# EasyEDA schematic 1-Schematic_PWM 四线 风扇控制器.json
TITLE: Sheet_1; REV: 1.0; Date: 2021-08-22; Sheet: 1/1; Drawn By: GloomyGhost; Company: Your Company
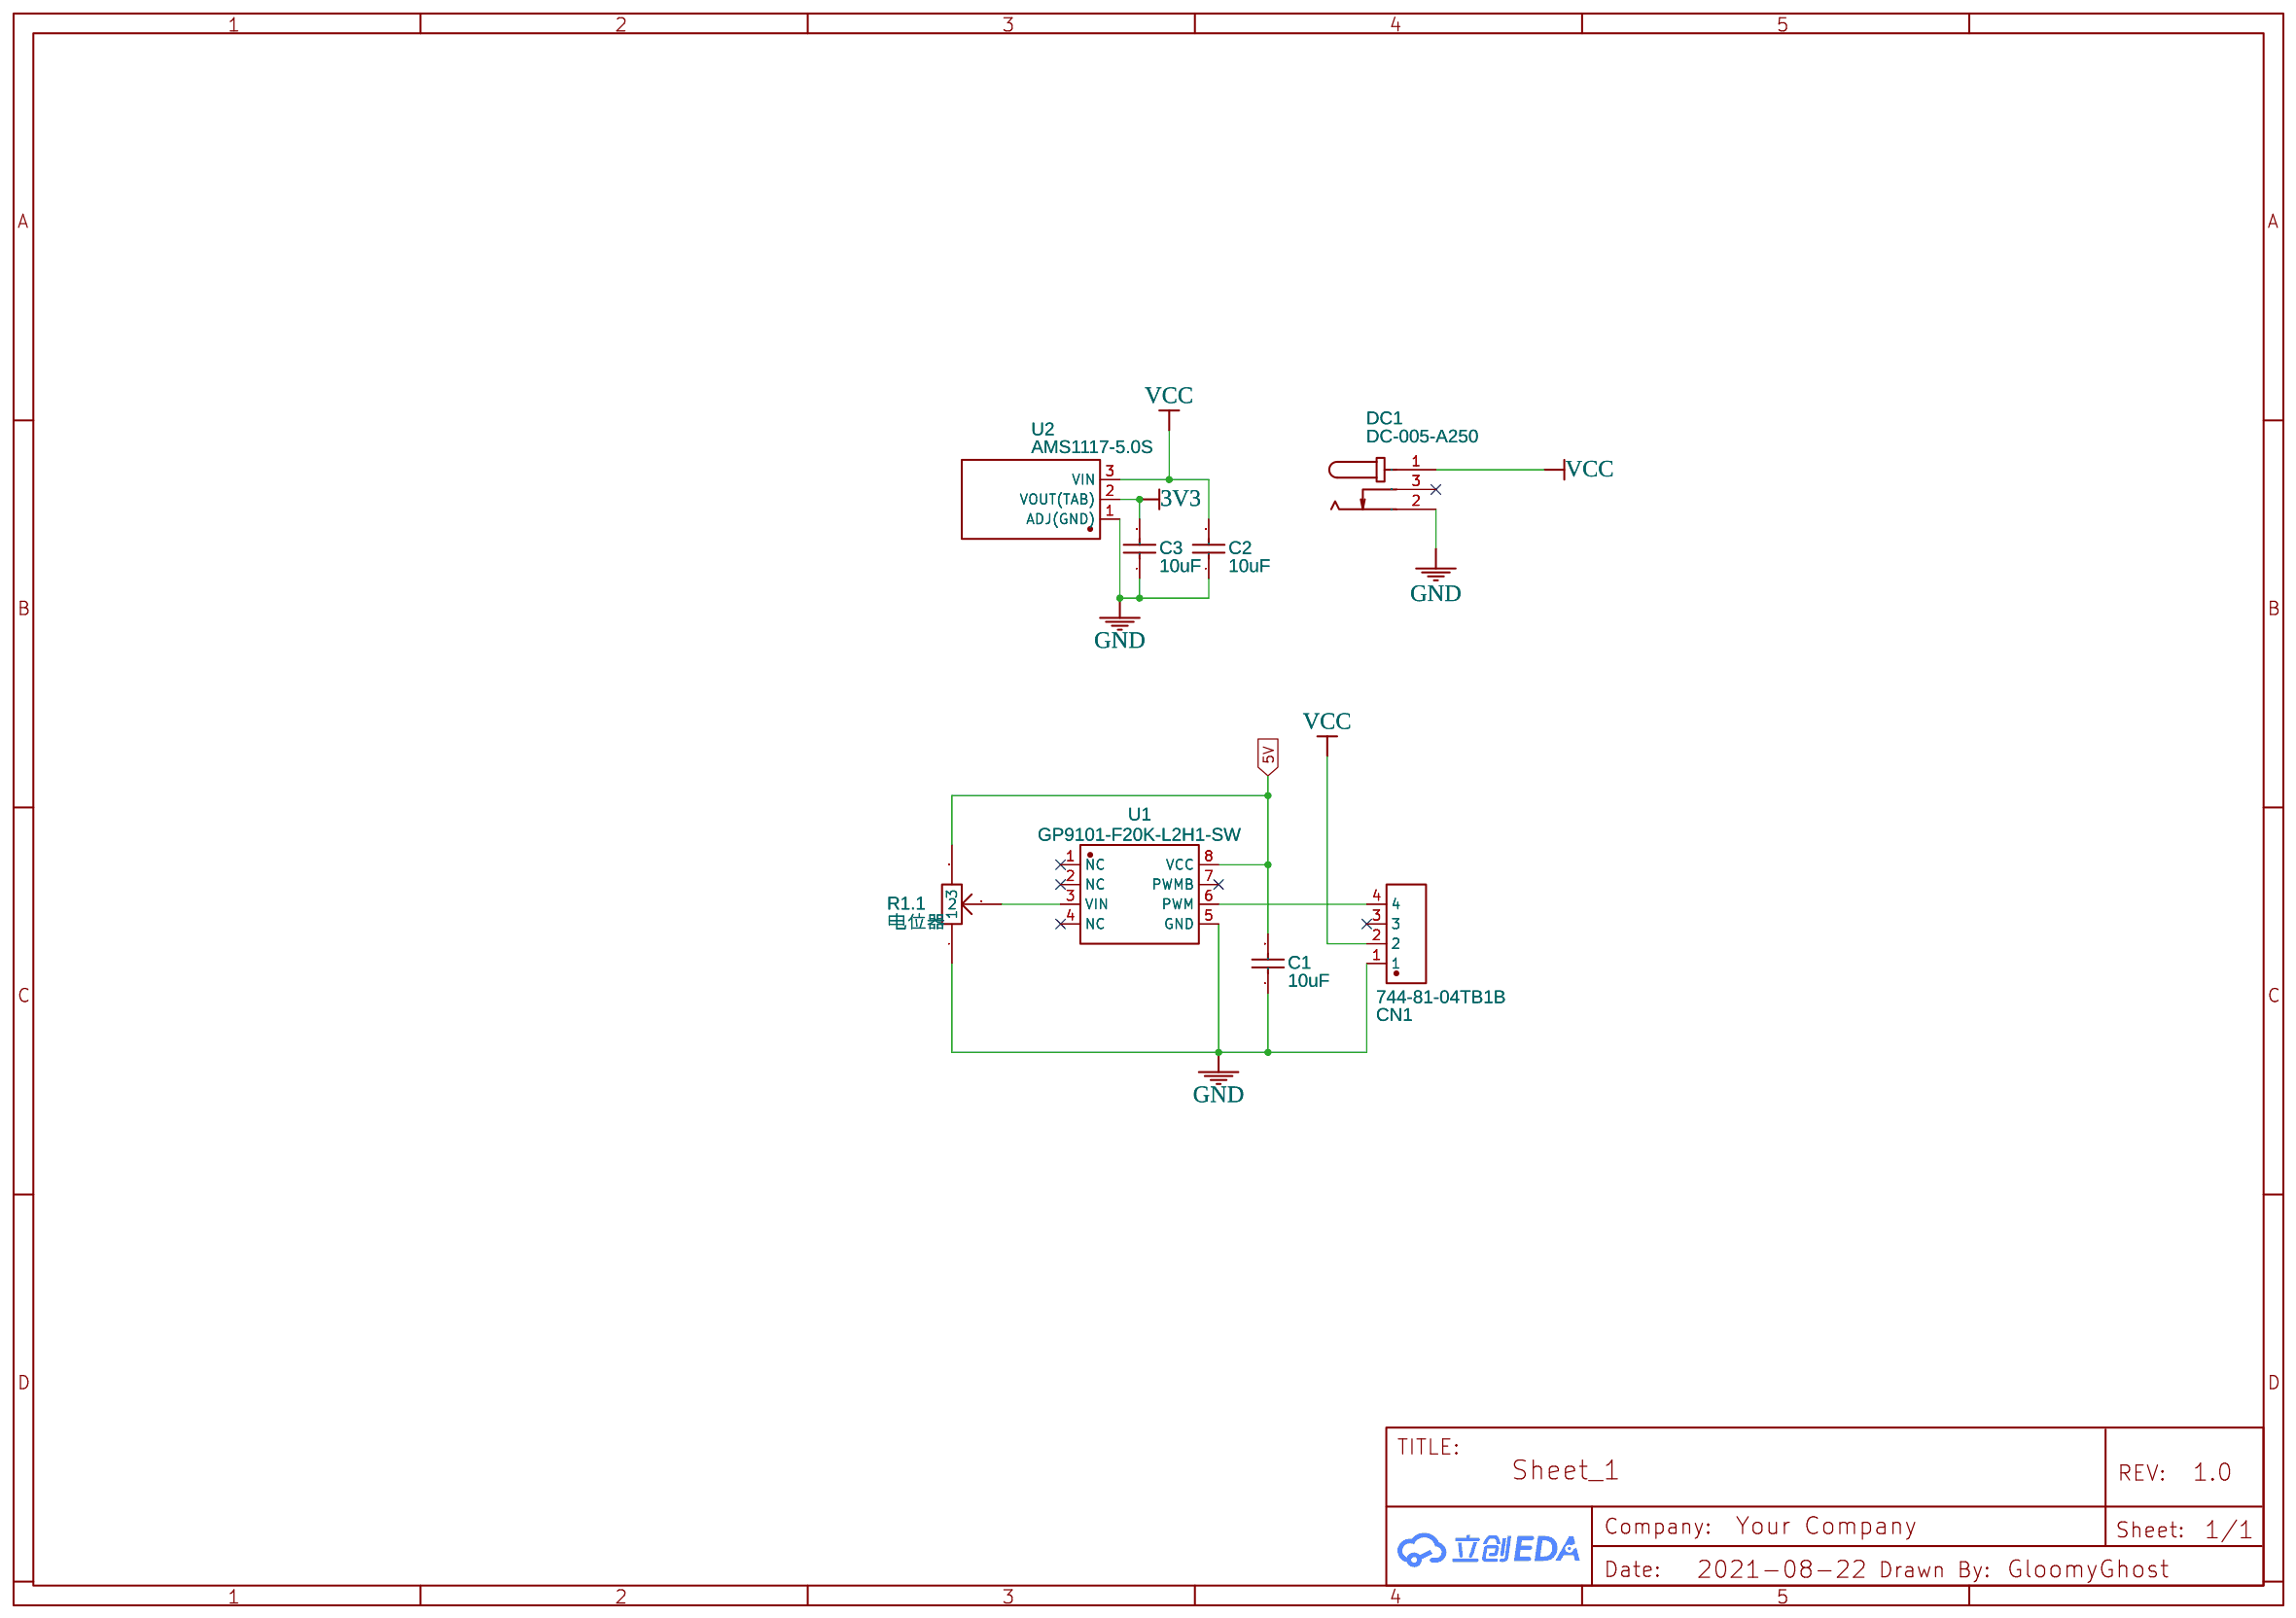
[diagram p0: schematic sheet]

## Parts
C1  10uF  [C0603]
C2  10uF  [C0603]
C3  10uF  [C0603]
CN1  744-81-04TB1B  [CONN-TH_4P-P2.54-V-M_744-81-04TXXX]
DC1  DC-005-A250  [DC-IN-TH_DC-005-A250]
R1  电位器  [双联电位器]  (section 1)
U1  GP9101-F20K-L2H1-SW  [SOP-8_L5.0-W3.9-P1.27-LS6.0-BL]
U2  AMS1117-5.0S  [SOT-89_L4.5-W2.5-P1.50-LS4.2-BR]

## Library data of the parts
C1-C3 = CL10A106MO8NQNC: Supplier: LCSC; Manufacturer: SAMSUNG; Supplier Part: C92487; Paste Type: expand; Assembly Type: smtWeld
CN1 = 744-81-04TB1B: Supplier: LCSC; Supplier Part: C402774; Manufacturer: PINREX; Contributor: LCSC; JLCPCB Part Class: Extended Part
DC1 = DC-005-A250: Supplier: LCSC; Supplier Part: C720558; Manufacturer: XUNPU(讯普); JLCPCB Part Class: Extended Part; Contributor: LCSC
R1 = 电位器: Contributor: GXYMJ; subpart_no: 2
U1 = GP9101-F20K-L2H1-SW: Supplier: LCSC; Supplier Part: C2837710; Manufacturer: Guestgood(客益); Contributor: LCSC
U2 = AMS1117-5.0S: Supplier: LCSC; Supplier Part: C351450; Manufacturer: Youtai Semiconductor Co., Ltd.; Contributor: LCSC; JLCPCB Part Class: Extended Part

## Nets
3V3: C3.2 U2.2(VOUT(TAB))
5V: C1.2 R1.3 U1.8(VCC)
GND: C1.1 C2.1 C3.1 CN1.1 DC1.2 R1.1 U1.5(GND) U2.1(ADJ(GND))
VCC: C2.2 CN1.2 DC1.1 U2.3(VIN)
Net-(CN1-4): CN1.4 U1.6(PWM)
Net-(R1.1-2): R1.2 U1.3(VIN)

Not connected (* = marked no-connect by the designer): CN1 3*; DC1 3*; U1 1(NC)* 2(NC)* 4(NC)* 7(PWMB)*
